# EAGLE schematic schematic (EAGLE 8.4.2)
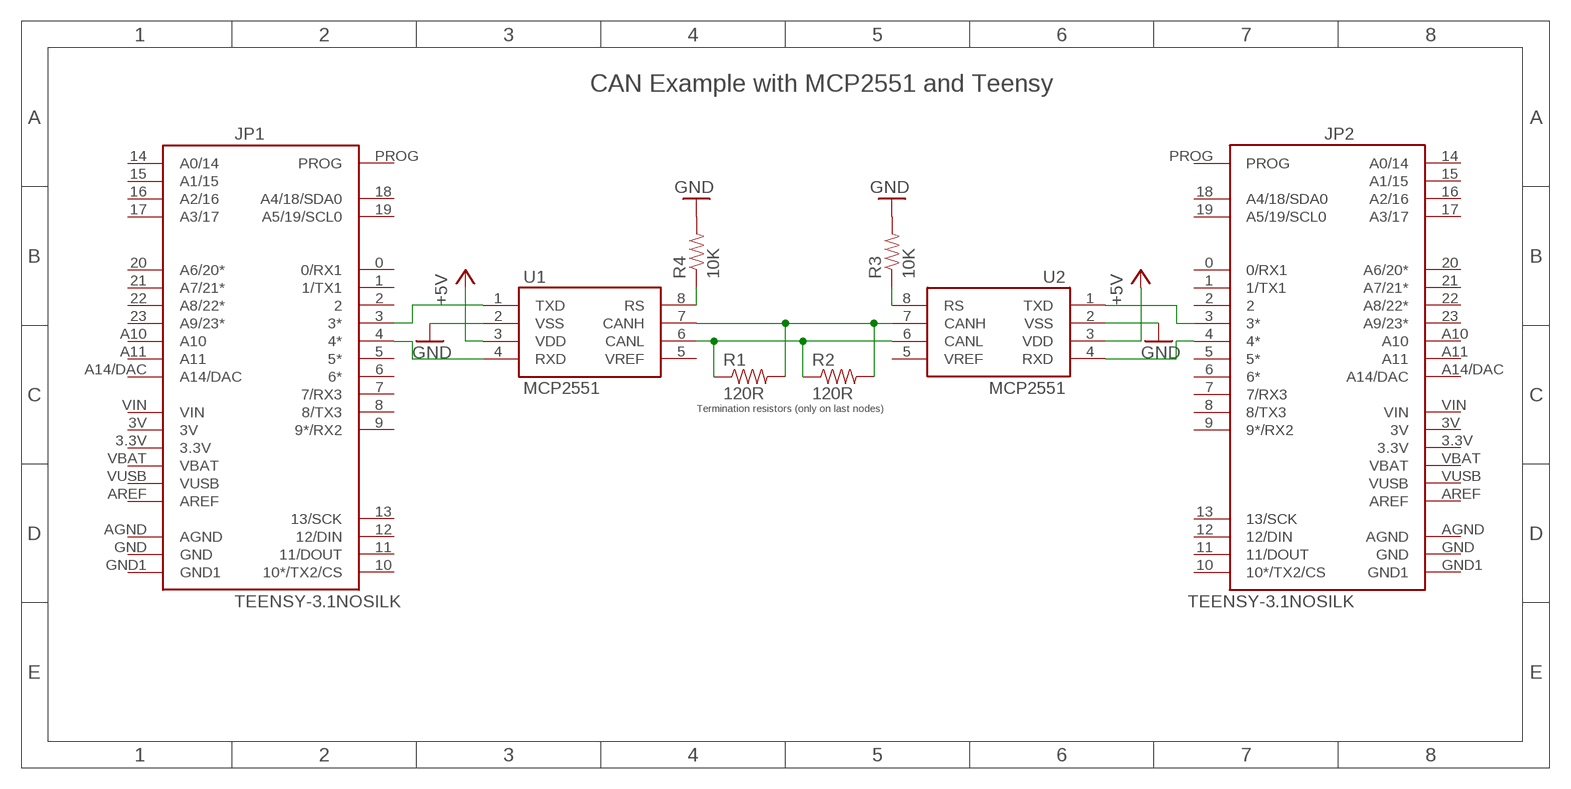
[diagram p0: schematic, sheet 1]

## Parts
JP1  TEENSY-3.1NOSILK  [TEENSY-3.1_NOSILK]
JP2  TEENSY-3.1NOSILK  [TEENSY-3.1_NOSILK]
R1  120R  RESISTOR0805-RES  [0805]
R2  120R  RESISTOR0805-RES  [0805]
R3  10K  RESISTOR0805-RES  [0805]
R4  10K  RESISTOR0805-RES  [0805]
U1  MCP2551  [SO08]
U2  MCP2551  [SO08]

## Nets
+5V: U1.3(VDD) U2.3(VDD)
GND: R3.2 R4.2 U1.2(VSS) U2.2(VSS)
N$1: R1.2 R2.2 U1.7(CANH) U2.7(CANH)
N$2: R1.1 R2.1 U1.6(CANL) U2.6(CANL)
N$3: R4.1 U1.8(RS)
N$4: R3.1 U2.8(RS)
N$5: JP1.3(3*) U1.1(TXD)
N$6: JP1.4(4*) U1.4(RXD)
N$7: JP2.4(4*) U2.4(RXD)
N$8: JP2.3(3*) U2.1(TXD)
Unconnected: JP1.0(0/RX1) JP1.1(1/TX1) JP1.2 JP1.3.3V JP1.3V JP1.5(5*) JP1.6(6*) JP1.7(7/RX3) JP1.8(8/TX3) JP1.9(9*/RX2) JP1.10(10*/TX2/CS) JP1.11(11/DOUT) JP1.12(12/DIN) JP1.13(13/SCK) JP1.14(A0/14) JP1.15(A1/15) JP1.16(A2/16) JP1.17(A3/17) JP1.18(A4/18/SDA0) JP1.19(A5/19/SCL0) JP1.20(A6/20*) JP1.21(A7/21*) JP1.22(A8/22*) JP1.23(A9/23*) JP1.A10 JP1.A11 JP1.A14/DAC JP1.AGND JP1.AREF JP1.GND JP1.GND1 JP1.PROG JP1.VBAT JP1.VIN JP1.VUSB JP2.0(0/RX1) JP2.1(1/TX1) JP2.2 JP2.3.3V JP2.3V JP2.5(5*) JP2.6(6*) JP2.7(7/RX3) JP2.8(8/TX3) JP2.9(9*/RX2) JP2.10(10*/TX2/CS) JP2.11(11/DOUT) JP2.12(12/DIN) JP2.13(13/SCK) JP2.14(A0/14) JP2.15(A1/15) JP2.16(A2/16) JP2.17(A3/17) JP2.18(A4/18/SDA0) JP2.19(A5/19/SCL0) JP2.20(A6/20*) JP2.21(A7/21*) JP2.22(A8/22*) JP2.23(A9/23*) JP2.A10 JP2.A11 JP2.A14/DAC JP2.AGND JP2.AREF JP2.GND JP2.GND1 JP2.PROG JP2.VBAT JP2.VIN JP2.VUSB U1.5(VREF) U2.5(VREF)

## Notes on the sheet
- CAN Example with MCP2551 and Teensy
- Termination resistors (only on last nodes)

## Library data of the parts
JP1 JP2 = SparkFun-Boards:TEENSY-3.1; SF_ID: DEV-12646
R1-R4 = SparkFun-Resistors:RESISTOR: Resistor Basic schematic elements and footprints for 0603, 1206, and PTH resistors.
U1 U2 = SparkFun-DigitalIC:MCP2551: CAN transceiver; PROD_ID: IC-09907